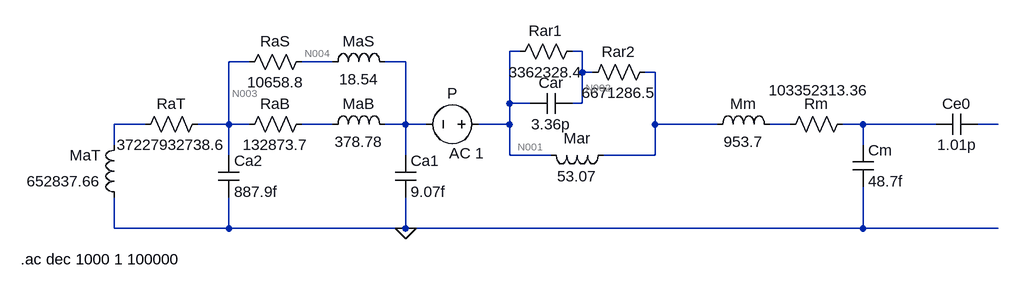
[diagram p0: schematic cap_mic_cap_full_transformers_circuit_refac.asc]
cap_mic_cap_full_transformers_circuit_refac.asc, the LTspice schematic file:
Version 4
SHEET 1 1432 680
WIRE 400 -48 384 -48
WIRE 496 -48 480 -48
WIRE -16 -32 -48 -32
WIRE 112 -32 64 -32
WIRE 224 -32 192 -32
WIRE 496 -16 496 -48
WIRE 512 -16 496 -16
WIRE 608 -16 592 -16
WIRE 384 32 384 -48
WIRE 416 32 384 32
WIRE 496 32 496 -16
WIRE 496 32 480 32
WIRE -176 64 -224 64
WIRE -48 64 -48 -32
WIRE -48 64 -96 64
WIRE -16 64 -48 64
WIRE 112 64 64 64
WIRE 224 64 224 -32
WIRE 224 64 192 64
WIRE 256 64 224 64
WIRE 384 64 384 32
WIRE 384 64 336 64
WIRE 608 64 608 -16
WIRE 704 64 608 64
WIRE 816 64 784 64
WIRE 928 64 896 64
WIRE 1040 64 928 64
WIRE 1136 64 1104 64
WIRE -224 96 -224 64
WIRE 928 96 928 64
WIRE -48 112 -48 64
WIRE 224 112 224 64
WIRE 384 112 384 64
WIRE 448 112 384 112
WIRE 608 112 608 64
WIRE 608 112 528 112
WIRE -224 224 -224 176
WIRE -48 224 -48 176
WIRE -48 224 -224 224
WIRE 224 224 224 176
WIRE 224 224 -48 224
WIRE 928 224 928 160
WIRE 928 224 224 224
WIRE 1136 224 928 224
FLAG 224 224 0
SYMBOL voltage 352 64 R90
WINDOW 0 -32 56 VBottom 2
WINDOW 3 32 56 VTop 2
WINDOW 123 29 34 VTop 2
WINDOW 39 0 0 Left 0
SYMATTR InstName P
SYMATTR Value ""
SYMATTR Value2 AC 1
SYMBOL res 80 48 R90
WINDOW 0 0 56 VBottom 2
WINDOW 3 32 56 VTop 2
SYMATTR InstName RaB
SYMATTR Value 132873.7
SYMBOL ind 96 80 R270
WINDOW 0 32 56 VTop 2
WINDOW 3 5 56 VBottom 2
SYMATTR InstName MaB
SYMATTR Value 378.78
SYMBOL ind 96 -16 R270
WINDOW 0 32 56 VTop 2
WINDOW 3 5 56 VBottom 2
SYMATTR InstName MaS
SYMATTR Value 18.54
SYMBOL res 80 -48 R90
WINDOW 0 0 56 VBottom 2
WINDOW 3 32 56 VTop 2
SYMATTR InstName RaS
SYMATTR Value 10658.8
SYMBOL cap -64 112 R0
SYMATTR InstName Ca2
SYMATTR Value 887.9f
SYMBOL cap 208 112 R0
SYMATTR InstName Ca1
SYMATTR Value 9.07f
SYMBOL res -80 48 R90
WINDOW 0 0 56 VBottom 2
WINDOW 3 32 56 VTop 2
SYMATTR InstName RaT
SYMATTR Value 37227932738.6
SYMBOL ind -208 192 R180
WINDOW 0 36 80 Left 2
WINDOW 3 36 40 Left 2
SYMATTR InstName MaT
SYMATTR Value 652837.66
SYMBOL ind 688 80 R270
WINDOW 0 32 56 VTop 2
WINDOW 3 5 56 VBottom 2
SYMATTR InstName Mm
SYMATTR Value 953.7
SYMBOL res 912 48 R90
WINDOW 0 0 56 VBottom 2
WINDOW 3 -52 52 VTop 2
SYMATTR InstName Rm
SYMATTR Value 103352313.36
SYMBOL cap 912 96 R0
SYMATTR InstName Cm
SYMATTR Value 48.7f
SYMBOL cap 1104 48 R90
WINDOW 0 0 32 VBottom 2
WINDOW 3 32 32 VTop 2
SYMATTR InstName Ce0
SYMATTR Value 1.01p
SYMBOL res 496 -64 R90
WINDOW 0 0 56 VBottom 2
WINDOW 3 32 56 VTop 2
SYMATTR InstName Rar1
SYMATTR Value 3362328.4
SYMBOL cap 480 16 R90
WINDOW 0 0 32 VBottom 2
WINDOW 3 32 32 VTop 2
SYMATTR InstName Car
SYMATTR Value 3.36p
SYMBOL res 608 -32 R90
WINDOW 0 0 56 VBottom 2
WINDOW 3 32 56 VTop 2
SYMATTR InstName Rar2
SYMATTR Value 6671286.5
SYMBOL ind 544 96 R90
WINDOW 0 5 56 VBottom 2
WINDOW 3 32 56 VTop 2
SYMATTR InstName Mar
SYMATTR Value 53.07
TEXT -368 272 Left 2 !.ac dec 1000 1 100000

The netlist it stands for:
* cap_mic_cap_full_transformers_circuit_refac.asc
V§P N001 N005 AC 1
RaB N008 N003 132873.7
L§MaB N008 N005 378.78
L§MaS N004 N005 18.54
RaS N004 N003 10658.8
Ca2 N003 0 887.9f
Ca1 N005 0 9.07f
RaT N003 N007 37227932738.6
L§MaT 0 N007 652837.66
L§Mm N006 N009 953.7
Rm N010 N009 103352313.36
Cm N010 0 48.7f
Ce0 N011 N010 1.01p
Rar1 N002 N001 3362328.4
Car N002 N001 3.36p
Rar2 N006 N002 6671286.5
L§Mar N006 N001 53.07
.ac dec 1000 1 100000
.backanno
.end

* Results of the author's LTspice run, read from the files saved beside the schematic
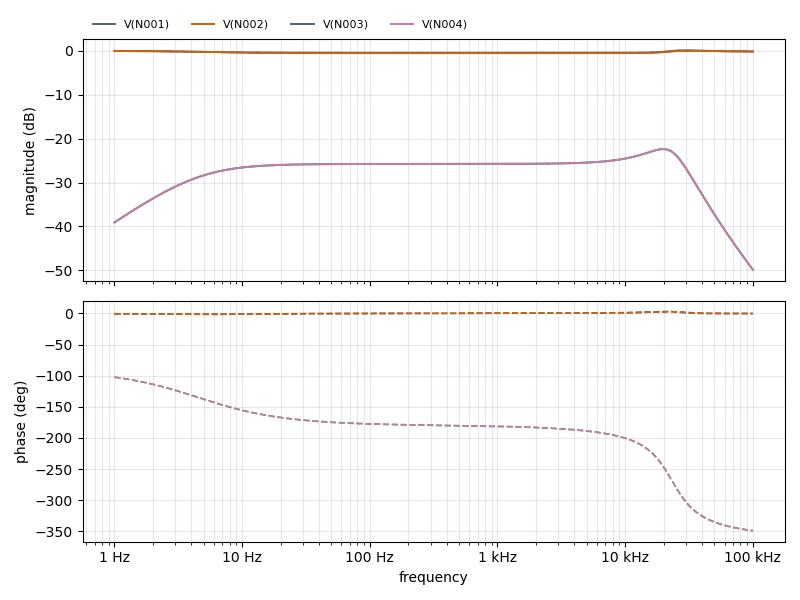
[diagram p1: AC Analysis of cap_mic_cap_full_transformers_circuit_refac.asc, plotted from the saved traces]
* AC Analysis, 1 run:
*   V(N001): -0.02 dB at 1 Hz, -0.14 dB at 100 kHz, peak 0.10 dB at 28.31 kHz
*   V(N002): -0.02 dB at 1 Hz, -0.14 dB at 100 kHz, peak 0.06 dB at 30.83 kHz
*   V(N003): -39.08 dB at 1 Hz, -49.84 dB at 100 kHz, peak -22.37 dB at 19.82 kHz, 3 dB below the peak at 5.541 kHz and 27.78 kHz
*   V(N004): -39.08 dB at 1 Hz, -49.84 dB at 100 kHz, peak -22.37 dB at 19.82 kHz, 3 dB below the peak at 5.541 kHz and 27.78 kHz